# EAGLE schematic HOMADOS (EAGLE 7.7.0)
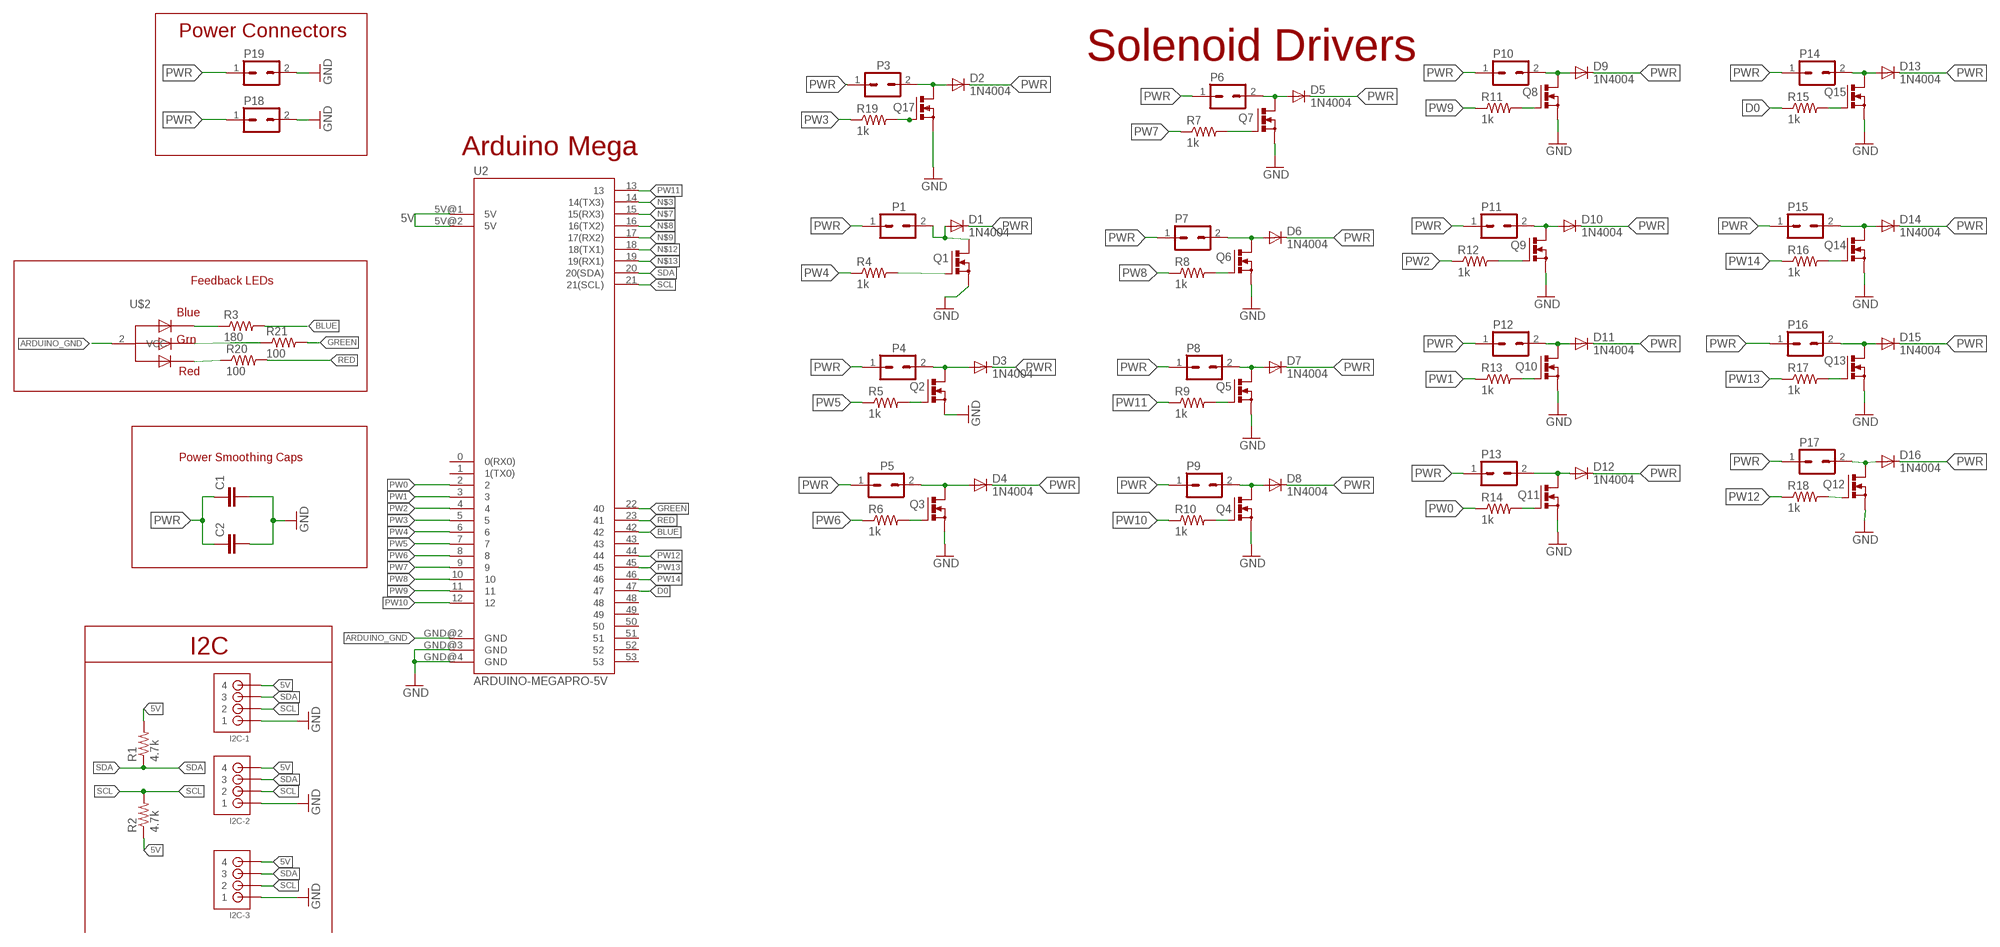
[diagram p0: schematic, sheet 1]

## Parts
C1  CAPPTH1  [CAP-PTH-5MM]
C2  CAPPTH3  [CAP-PTH-LARGE]
D1  1N4004  [DO41-10]
D2  1N4004  [DO41-10]
D3  1N4004  [DO41-10]
D4  1N4004  [DO41-10]
D5  1N4004  [DO41-10]
D6  1N4004  [DO41-10]
D7  1N4004  [DO41-10]
D8  1N4004  [DO41-10]
D9  1N4004  [DO41-10]
D10  1N4004  [DO41-10]
D11  1N4004  [DO41-10]
D12  1N4004  [DO41-10]
D13  1N4004  [DO41-10]
D14  1N4004  [DO41-10]
D15  1N4004  [DO41-10]
D16  1N4004  [DO41-10]
I2C-1  JST-PH_4-PIN_HEADER  [JST_B4B-PH_HEADER]
I2C-2  JST-PH_4-PIN_HEADER  [JST_B4B-PH_HEADER]
I2C-3  JST-PH_4-PIN_HEADER  [JST_B4B-PH_HEADER]
P1  39-30-02  [39-30-?02?]
P3  39-30-02  [39-30-?02?]
P4  39-30-02  [39-30-?02?]
P5  39-30-02  [39-30-?02?]
P6  39-30-02  [39-30-?02?]
P7  39-30-02  [39-30-?02?]
P8  39-30-02  [39-30-?02?]
P9  39-30-02  [39-30-?02?]
P10  39-30-02  [39-30-?02?]
P11  39-30-02  [39-30-?02?]
P12  39-30-02  [39-30-?02?]
P13  39-30-02  [39-30-?02?]
P14  39-30-02  [39-30-?02?]
P15  39-30-02  [39-30-?02?]
P16  39-30-02  [39-30-?02?]
P17  39-30-02  [39-30-?02?]
P18  39-30-02  [39-30-?02?]
P19  39-30-02  [39-30-?02?]
Q1  PMOSFET_NTO220BV  [TO220BV]
Q2  PMOSFET_NTO220BV  [TO220BV]
Q3  PMOSFET_NTO220BV  [TO220BV]
Q4  PMOSFET_NTO220BV  [TO220BV]
Q5  PMOSFET_NTO220BV  [TO220BV]
Q6  PMOSFET_NTO220BV  [TO220BV]
Q7  PMOSFET_NTO220BV  [TO220BV]
Q8  PMOSFET_NTO220BV  [TO220BV]
Q9  PMOSFET_NTO220BV  [TO220BV]
Q10  PMOSFET_NTO220BV  [TO220BV]
Q11  PMOSFET_NTO220BV  [TO220BV]
Q12  PMOSFET_NTO220BV  [TO220BV]
Q13  PMOSFET_NTO220BV  [TO220BV]
Q14  PMOSFET_NTO220BV  [TO220BV]
Q15  PMOSFET_NTO220BV  [TO220BV]
Q17  PMOSFET_NTO220BV  [TO220BV]
R1  4.7k  RESISTORKIT  [AXIAL-0.3-KIT]
R2  4.7k  RESISTORKIT  [AXIAL-0.3-KIT]
R3  180  RESISTORKIT  [AXIAL-0.3-KIT]
R4  1k  RESISTORKIT  [AXIAL-0.3-KIT]
R5  1k  RESISTORKIT  [AXIAL-0.3-KIT]
R6  1k  RESISTORKIT  [AXIAL-0.3-KIT]
R7  1k  RESISTORKIT  [AXIAL-0.3-KIT]
R8  1k  RESISTORKIT  [AXIAL-0.3-KIT]
R9  1k  RESISTORKIT  [AXIAL-0.3-KIT]
R10  1k  RESISTORKIT  [AXIAL-0.3-KIT]
R11  1k  RESISTORKIT  [AXIAL-0.3-KIT]
R12  1k  RESISTORKIT  [AXIAL-0.3-KIT]
R13  1k  RESISTORKIT  [AXIAL-0.3-KIT]
R14  1k  RESISTORKIT  [AXIAL-0.3-KIT]
R15  1k  RESISTORKIT  [AXIAL-0.3-KIT]
R16  1k  RESISTORKIT  [AXIAL-0.3-KIT]
R17  1k  RESISTORKIT  [AXIAL-0.3-KIT]
R18  1k  RESISTORKIT  [AXIAL-0.3-KIT]
R19  1k  RESISTORKIT  [AXIAL-0.3-KIT]
R20  100  RESISTORKIT  [AXIAL-0.3-KIT]
R21  100  RESISTORKIT  [AXIAL-0.3-KIT]
U2  ARDUINO-MEGAPRO-5V  [ARDUINO_MEGA-PRO-5V]
U$2  RGBLED_CA  [LED5MMRGB]

## Nets
5V: I2C-1.P4 I2C-2.P4 I2C-3.P4 R1.P$2 R2.P$1 U2.5V@1(5V) U2.5V@2(5V)
A0: R3.P$1 U$2.4(BLUE)
A2: R20.P$1 U$2.1(RED)
ARDUINO_GND: U2.GND@2(GND) U$2.2(VCC)
BLUE: R3.P$2 U2.42
D0: R15.P$1 U2.47
GND: C1.2 C2.2 I2C-1.P1 I2C-2.P1 I2C-3.P1 P18.2 P19.2 Q1.S Q2.S Q3.S Q4.S Q5.S Q6.S Q7.S Q8.S Q9.S Q10.S Q11.S Q12.S Q13.S Q14.S Q15.S Q17.S U2.GND@3(GND) U2.GND@4(GND)
GREEN: R21.P$2 U2.22
N$1: R21.P$1 U$2.3(GREEN)
N$2: D2.A P3.2 Q17.D
N$3: U2.14(14(TX3))
N$4: D5.A P6.2 Q7.D
N$5: D12.A P13.2 Q11.D
N$6: Q17.G R19.P$2
N$7: U2.15(15(RX3))
N$8: U2.16(16(TX2))
N$9: U2.17(17(RX2))
N$10: Q1.G R4.P$2
N$11: D13.A P14.2 Q15.D
N$12: U2.18(18(TX1))
N$13: U2.19(19(RX1))
N$14: Q2.G R5.P$2
N$15: D1.A P1.2 Q1.D
N$16: D3.A P4.2 Q2.D
N$18: Q3.G R6.P$2
N$19: D4.A P5.2 Q3.D
N$20: D6.A P7.2 Q6.D
N$21: D7.A P8.2 Q5.D
N$22: Q7.G R7.P$2
N$23: D11.A P12.2 Q10.D
N$24: D14.A P15.2 Q14.D
N$25: D15.A P16.2 Q13.D
N$26: Q6.G R8.P$2
N$27: D8.A P9.2 Q4.D
N$30: Q5.G R9.P$2
N$31: D16.A P17.2 Q12.D
N$33: D10.A P11.2 Q9.D
N$34: Q4.G R10.P$2
N$35: D9.A P10.2 Q8.D
N$38: Q8.G R11.P$2
N$42: Q9.G R12.P$2
N$46: Q10.G R13.P$2
N$50: Q11.G R14.P$2
N$54: Q15.G R15.P$2
N$58: Q14.G R16.P$2
N$62: Q13.G R17.P$2
N$66: Q12.G R18.P$2
PW0: R14.P$1 U2.2
PW1: R13.P$1 U2.3
PW2: R12.P$1 U2.4
PW3: R19.P$1 U2.5
PW4: R4.P$1 U2.6
PW5: R5.P$1 U2.7
PW6: R6.P$1 U2.8
PW7: R7.P$1 U2.9
PW8: R8.P$1 U2.10
PW9: R11.P$1 U2.11
PW10: R10.P$1 U2.12
PW11: R9.P$1 U2.13
PW12: R18.P$1 U2.44
PW13: R17.P$1 U2.45
PW14: R16.P$1 U2.46
PWR: C1.1 C2.1 D1.C D2.C D3.C D4.C D5.C D6.C D7.C D8.C D9.C D10.C D11.C D12.C D13.C D14.C D15.C D16.C P1.1 P3.1 P4.1 P5.1 P6.1 P7.1 P8.1 P9.1 P10.1 P11.1 P12.1 P13.1 P14.1 P15.1 P16.1 P17.1 P18.1 P19.1
RED: R20.P$2 U2.23
SCL: I2C-1.P2 I2C-2.P2 I2C-3.P2 R2.P$2 U2.21(21(SCL))
SDA: I2C-1.P3 I2C-2.P3 I2C-3.P3 R1.P$1 U2.20(20(SDA))
Unconnected: U2.0(0(RX0)) U2.1(1(TX0)) U2.43 U2.48 U2.49 U2.50 U2.51 U2.52 U2.53

## Notes on the sheet
- Power Connectors
- Solenoid Drivers
- Arduino Mega
- Feedback LEDs
- Power Smoothing Caps
- I2C

## Library data of the parts
C1 C2 = SparkFun-Passives:CAP: Capacitor Standard 0603 ceramic capacitor, and 0.1" leaded capacitor.
D1-D16 = adafruit:1N4004: DIODE General purpose 1N400x type rectifier (With bigger pads) http://www.ladyada.net/library/pcb/eaglelibrary.html
I2C-1-I2C-3 = JST_connectors:JST-PH_4-PIN_HEADER: 4-pin JST PH Shrouded Header, top entry P/N B4B-PH-K-S Mating connector PHR-4 Mating cable assembly: Sparkfun PRT-09916 <http://www.sparkfun.com/products/9916>
P1 P3-P19 = con-molex-mini-fit:39-30-?02?: HEADER
Q1-Q15 Q17 = transistor-power:PMOSFET_N: Power MOSFET N-Channel
R1-R21 = SparkFun-Passives:RESISTOR: Resistor Basic schematic elements and footprints for 0603, 1206, and PTH resistors.
U2 = SparkFun-Minimal-Shields:ARDUINO-MEGA: Arduino Mega board footprint
U$2 = adafruit:RGBLED_CA: RGB LED, common-anode Staggered pins http://www.ladyada.net/library/pcb/eaglelibrary.html

## Net classes
0 default: width 0.406 mm, drill 0.762 mm, clearance 0.406 mm
1 PWR: width 1.016 mm, drill 0.762 mm, clearance 0.508 mm
2 GND: width 1.016 mm, drill 0.762 mm, clearance 1.016 mm